# EAGLE design blink (EAGLE 7.7.0)
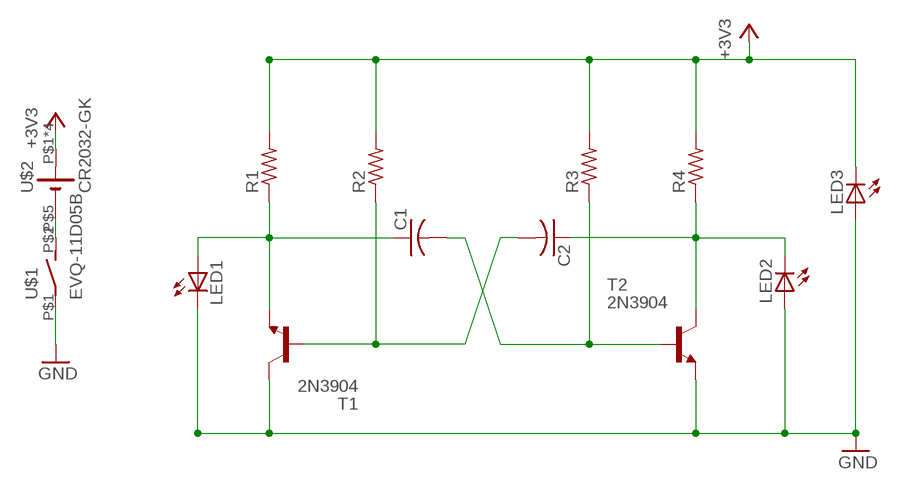
[diagram p0: schematic, sheet 1]

## Parts
C1  C-US025-030X050  [C025-030X050]
C2  C-US025-030X050  [C025-030X050]
LED1  LED3MM  [LED3MM]
LED2  LED3MM  [LED3MM]
LED3  LED5MM  [LED5MM]
R1  R-US_0207/7  [0207/7]
R2  R-US_0207/7  [0207/7]
R3  R-US_0207/7  [0207/7]
R4  R-US_0207/7  [0207/7]
T1  2N3904  [TO92]
T2  2N3904  [TO92]
U$1  EVQ-11D05B  [SPST-5MM]
U$2  CR2032-GK  [BAT-HLD-001-THM]

## Nets
+3V3: LED3.K(C) R1.2 R2.2 R3.2 R4.2 U$2.P$1(+) U$2.P$2(+) U$2.P$3(+) U$2.P$4(+)
GND: LED1.K(C) LED2.A LED3.A T1.1(C) T2.3(E) U$1.P$1(P)
N$1: C1.1 LED1.A R1.1 T1.3(E)
N$2: U$1.P$2(S) U$2.P$5(-)
N$3: C2.1 LED2.K(C) R4.1 T2.1(C)
N$4: C1.2 R3.1 T2.2(B)
N$5: C2.2 R2.1 T1.2(B)

## Library data of the parts
C1 C2 = resistor:C-US: CAPACITOR, American symbol
LED1-LED3 = led:LED: LED OSRAM: - CHIPLED LG R971, LG N971, LY N971, LG Q971, LY Q971, LO R971, LY R971 LH N974, LH R974 LS Q976, LO Q976, LY Q976 LO Q996 - Hyper CHIPLED LW Q18S LB Q993, LB Q99A, LB R99A - SideLED LS A670, LO A670, LY A670, LG A670, LP A670 LB A673, LV A673, LT A673, LW A673 LH A674 LY A675 LS A676, LA A676, LO A676, LY A676, LW A676 LS A679, LY A679, LG A679 - Hyper Micro SIDELED® LS Y876, LA Y876, LO Y876, LY Y876 LT Y87S - SmartLED LW L88C, LW L88S LB L89C, LB L89S, LG L890 LS L89K, LO L89K, LY L89K LS L896, LA L896, LO L896, LY L896 - TOPLED LS T670, LO T670, LY T670, LG T670, LP T670 LSG T670, LSP T670, LSY T670, LOP T670, LYG T670 LG T671, LOG T671, LSG T671 LB T673, LV T673, LT T673, LW T673 LH T674 LS T676, LA T676, LO T676, LY T676, LB T676, LH T676, LSB T676, LW T676 LB T67C, LV T67C, LT T67C, LS T67K, LO T67K, LY T67K, LW E67C LS E67B, LA E67B, LO E67B, LY E67B, LB E67C, LV E67C, LT E67C LW T67C LS T679, LY T679, LG T679 LS T770, LO T770, LY T770, LG T770, LP T770 LB T773, LV T773, LT T773, LW T773 LH T774 LS E675, LA E675, LY E675, LS T675 LS T776, LA T776, LO T776, LY T776, LB T776 LHGB T686 LT T68C, LB T68C - Hyper Mini TOPLED® LB M676 - Mini TOPLED Santana® LG M470 LS M47K, LO M47K, LY M47K Source: http://www.osram.convergy.de LUXEON: - LUMILED® LXK2-PW12-R00, LXK2-PW12-S00, LXK2-PW14-U00, LXK2-PW14-V00 LXK2-PM12-R00, LXK2-PM12-S00, LXK2-PM14-U00 LXK2-PE12-Q00, LXK2-PE12-R00, LXK2-PE12-S00, LXK2-PE14-T00, LXK2-PE14-U00 LXK2-PB12-K00, LXK2-PB12-L00, LXK2-PB12-M00, LXK2-PB14-N00, LXK2-PB14-P00, LXK2-PB14-Q00 LXK2-PR12-L00, LXK2-PR12-M00, LXK2-PR14-Q00, LXK2-PR14-R00 LXK2-PD12-Q00, LXK2-PD12-R00, LXK2-PD12-S00 LXK2-PH12-R00, LXK2-PH12-S00 LXK2-PL12-P00, LXK2-PL12-Q00, LXK2-PL12-R00 Source: www.luxeon.com KINGBRIGHT: KA-3528ASYC Source: www.kingbright.com
R1-R4 = resistor:R-US_: RESISTOR, American symbol
T1 T2 = transistor:2N3904: NPN TRANSISTOR
U$1 = switch:EVQ-11D05B: EVQ-11D05B Panasonic Tactile Switches Switch, Light Touch, SMD, 3.5x2.9mm Righ Side-operational Half Dive, L-Shape 2.2N, H=0.7mm
U$2 = battery:CR2032-GK

## Board
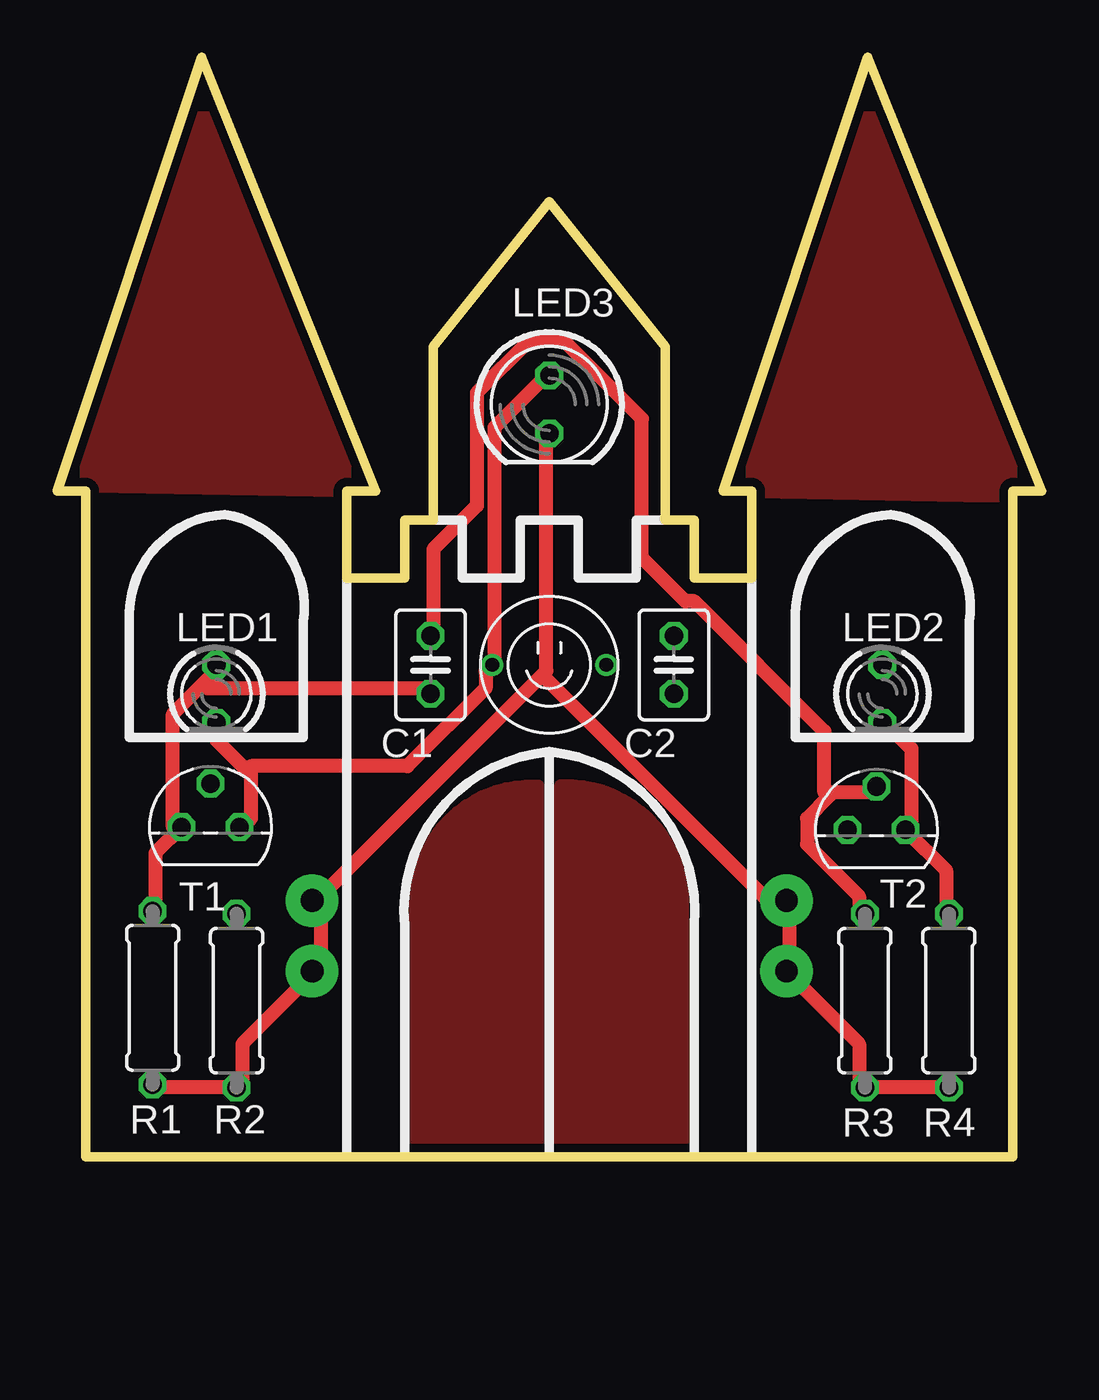
[diagram p1: board, top side]
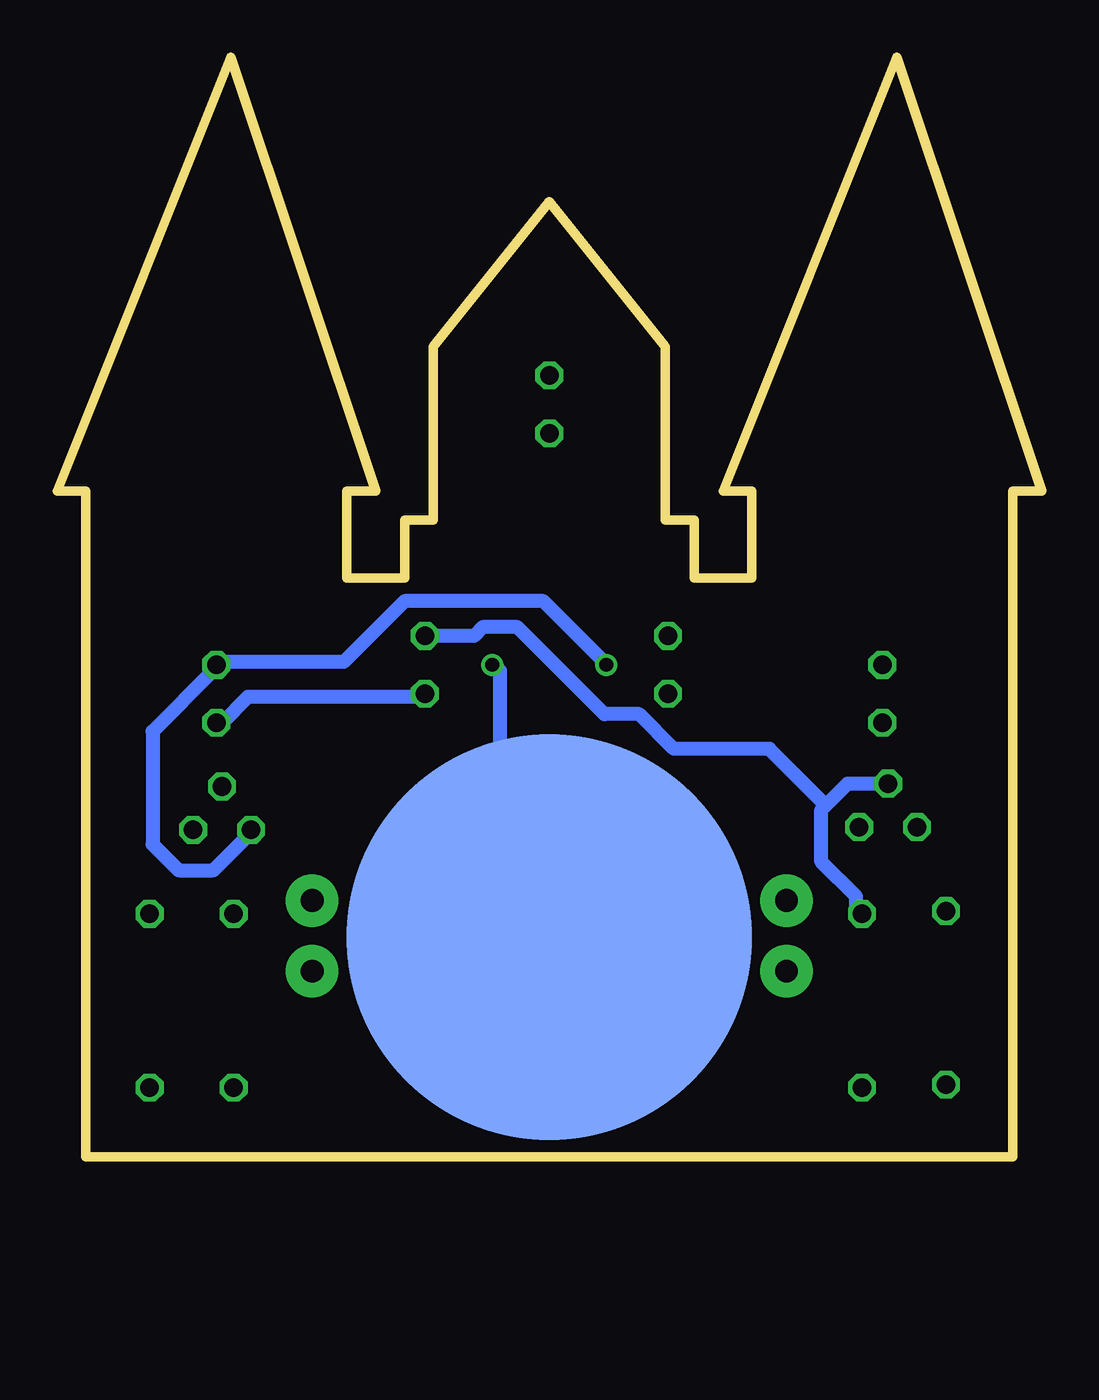
[diagram p2: board, bottom side, seen from below]

Size 43.18 x 48.26 mm. Coordinates in mm from the lower left corner, seen from the top.
Outline: 1.27,0 1.27,29.21 0,29.21 6.35,48.26 13.97,29.21 12.7,29.21 12.7,25.4 15.24,25.4 15.24,27.94 16.51,27.94 16.51,35.56 21.59,41.91 26.67,35.56 26.67,27.94 27.94,27.94 27.94,25.4 30.48,25.4 30.48,29.21 29.21,29.21 35.56,48.26 43.18,29.21 41.91,29.21 41.91,0 1.27,0
Copper layers (1*16): Top 0.0356mm / dielectric 1.5011mm / Bottom 0.0356mm
Design rules "oshpark-2layer *": minimum track width 24mil, minimum drill 13mil, track to track 6mil, track to pad 24mil, pad to pad 6mil, via to via 6mil, smd to smd 6mil, copper to edge 15mil, drill to drill 6mil, minimum pad ring 7mil, minimum via ring 7mil, stop-mask expansion 2.5mil, vias tented up to drill 0mil, thermal gap 10mil

### Footprints (pad centres in the part's own frame; a part is rotated, then mirrored left to right if it is on the bottom)
C025-030X050 = drill 0.813 octagon: 1 -1.27,0; 2 1.27,0
LED3MM = drill 0.813 octagon: A -1.27,0; K 1.27,0
LED5MM = drill 0.813 octagon: A -1.27,0; K 1.27,0
0207/7 = drill 0.813 octagon: 1 -3.81,0; 2 3.81,0
TO92 = drill 0.813 octagon: 1 1.27,0; 2 0,1.905; 3 -1.27,0
SPST-5MM = drill 0.6: P$1 -2.5,0; P$2 2.5,0
BAT-HLD-001-THM = drill 1 pad 2.3: P$1 10.4,1.5; P$2 10.4,-1.6; P$3 -10.4,1.5; P$4 -10.4,-1.6 | smd 17.8 x 17.8: P$5 0,0

### Placement (x,y rotation side)
C1  16.38,21.59 90 top
C2  27.05,21.59 90 top
LED1  6.98,20.32 270 top
LED2  36.2,20.32 270 top
LED3  21.59,33.02 270 top
R1  4.19,6.98 270 top
R2  7.87,6.86 270 top
R3  35.43,6.86 270 top
R4  39.12,6.86 270 top
T1  6.73,14.48 0 top
T2  35.94,14.35 0 top
U$1  21.59,21.59 0 top
U$2  21.59,9.65 180 bottom

### Tracks (layer width: path | path; a pad name or v marks a point on that pad's centre or on a via)
+3V3
  Top 0.61: R4.2 R3.2 35.18,3.05 35.18,4.95 32.13,8 U$2.P$1 32.13,8.38 32.13,11.05 U$2.P$2 31.75,11.43 30.99,11.43 21.27,21.15 | R1.2 4.32,3.05 R2.2 8.13,3.05 8.13,4.95 11.18,8 U$2.P$3 11.56,8.38 11.56,11.05 U$2.P$4 11.56,11.43 21.27,21.15 | 21.27,21.15 21.46,21.34 21.46,31.62 LED3.K
GND
  Top 0.61: LED1.K 6.98,18.29 8.32,16.96 | 8.32,16.96 8.51,16.76 8.51,14.86 8.13,14.48 T1.1 | LED3.A 21.46,34.29 19.18,32 19.18,21.72 U$1.P$1 18.8,21.34 18.8,20.57 15.37,17.14 8.51,17.14 8.32,16.96
  Bottom 0.61: T2.3 34.8,14.1 36.32,12.57 37.85,12.57 38.99,13.72 38.99,18.67 36.32,21.34 LED2.A 35.94,21.72 30.61,21.72 27.94,24.38 21.84,24.38 19.18,21.72 U$1.P$1
N$1
  Top 0.61: R1.1 4.32,11.05 4.32,13.33 T1.3 5.08,14.48 5.08,19.43 6.41,20.77 | 6.41,20.77 6.98,21.34 LED1.A | C1.1 16.13,20.57 6.6,20.57 6.41,20.77
N$2
  Bottom 0.61: U$2.P$5 23.75,11.81 23.75,21.34 U$1.P$2
N$3
  Top 0.61: R4.1 38.99,10.67 38.99,12.57 T2.1 37.46,14.48 37.46,17.91 36.32,19.05 LED2.K
  Bottom 0.61: C2.1 27.18,20.19 34.8,20.19 35.94,19.05 LED2.K
N$4
  Top 0.61: 33.85,15.81 34.04,16 35.94,16 T2.2 | 33.85,15.81 32.89,14.86 32.89,13.72 35.18,11.43 35.18,10.67 R3.1 | C1.2 16.51,22.86 16.51,26.67 18.41,28.57 18.41,33.53 20.7,35.81 22.23,35.81 25.65,32.38 25.65,26.29 27.56,24.38 27.94,24.38 33.66,18.67 33.66,16 33.85,15.81
N$5
  Bottom 0.61: T1.2 8.51,16.38 9.46,15.43 | 9.46,15.43 9.65,15.24 9.65,12.95 8.13,11.43 8.13,10.67 R2.1 | C2.2 24.89,22.86 24.51,23.24 22.99,23.24 19.18,19.43 17.65,19.43 16.13,17.91 11.94,17.91 9.46,15.43
N$6
  pour Top: 6.35,47.75 13.72,29.21 0.25,29.46
N$7
  pour Top: 29.46,29.21 35.56,48.01 43.18,28.96
N$8
  pour Top: 15.75,0.25 15.75,11.43 arc-90 21.08,16.26 21.08,0.51 arc90 20.83,0.25
N$9
  pour Top: 22.35,0.25 27.43,0.25 27.43,11.43 arc90 22.1,16.26 22.1,0.51 arc90